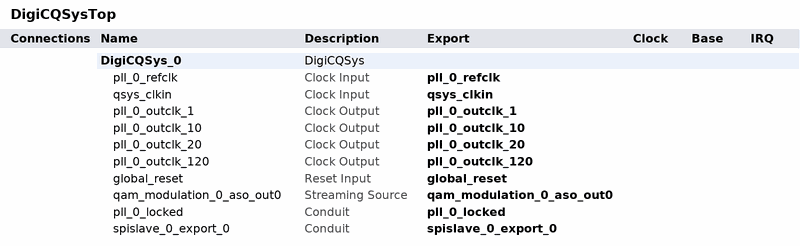
[diagram p0: system contents]
# Platform Designer (Qsys) system DigiCQSysTop, Cyclone V 5CSXFC6D6F31C6
# Parameters at their usual value, and those the tool derives, are not listed.
package require qsys
create_system DigiCQSysTop
set_project_property DEVICE_FAMILY {Cyclone V}
set_project_property DEVICE 5CSXFC6D6F31C6

add_instance DigiCQSys_0 DigiCQSys 1.0
set_instance_property DigiCQSys_0 AUTO_EXPORT true

# exported interfaces
add_interface global_reset reset sink
set_interface_property global_reset EXPORT_OF DigiCQSys_0.global_reset
add_interface pll_0_locked conduit end
set_interface_property pll_0_locked EXPORT_OF DigiCQSys_0.pll_0_locked
add_interface pll_0_outclk_1 clock source
set_interface_property pll_0_outclk_1 EXPORT_OF DigiCQSys_0.pll_0_outclk_1
add_interface pll_0_outclk_10 clock source
set_interface_property pll_0_outclk_10 EXPORT_OF DigiCQSys_0.pll_0_outclk_10
add_interface pll_0_outclk_120 clock source
set_interface_property pll_0_outclk_120 EXPORT_OF DigiCQSys_0.pll_0_outclk_120
add_interface pll_0_outclk_20 clock source
set_interface_property pll_0_outclk_20 EXPORT_OF DigiCQSys_0.pll_0_outclk_20
add_interface pll_0_refclk clock sink
set_interface_property pll_0_refclk EXPORT_OF DigiCQSys_0.pll_0_refclk
add_interface qam_modulation_0_aso_out0 avalon_streaming source
set_interface_property qam_modulation_0_aso_out0 EXPORT_OF DigiCQSys_0.qam_modulation_0_aso_out0
add_interface qsys_clkin clock sink
set_interface_property qsys_clkin EXPORT_OF DigiCQSys_0.qsys_clkin
add_interface spislave_0_export_0 conduit end
set_interface_property spislave_0_export_0 EXPORT_OF DigiCQSys_0.spislave_0_export_0

set_interconnect_requirement {$system} qsys_mm.clockCrossingAdapter HANDSHAKE
set_interconnect_requirement {$system} qsys_mm.enableEccProtection FALSE
set_interconnect_requirement {$system} qsys_mm.insertDefaultSlave FALSE
set_interconnect_requirement {$system} qsys_mm.maxAdditionalLatency 1

save_system DigiCQSysTop.qsys
